# Altium schematic sheet Reset Bootloader and Mounting.SchDoc
size A; SheetNumber: 3; SheetTotal: 9
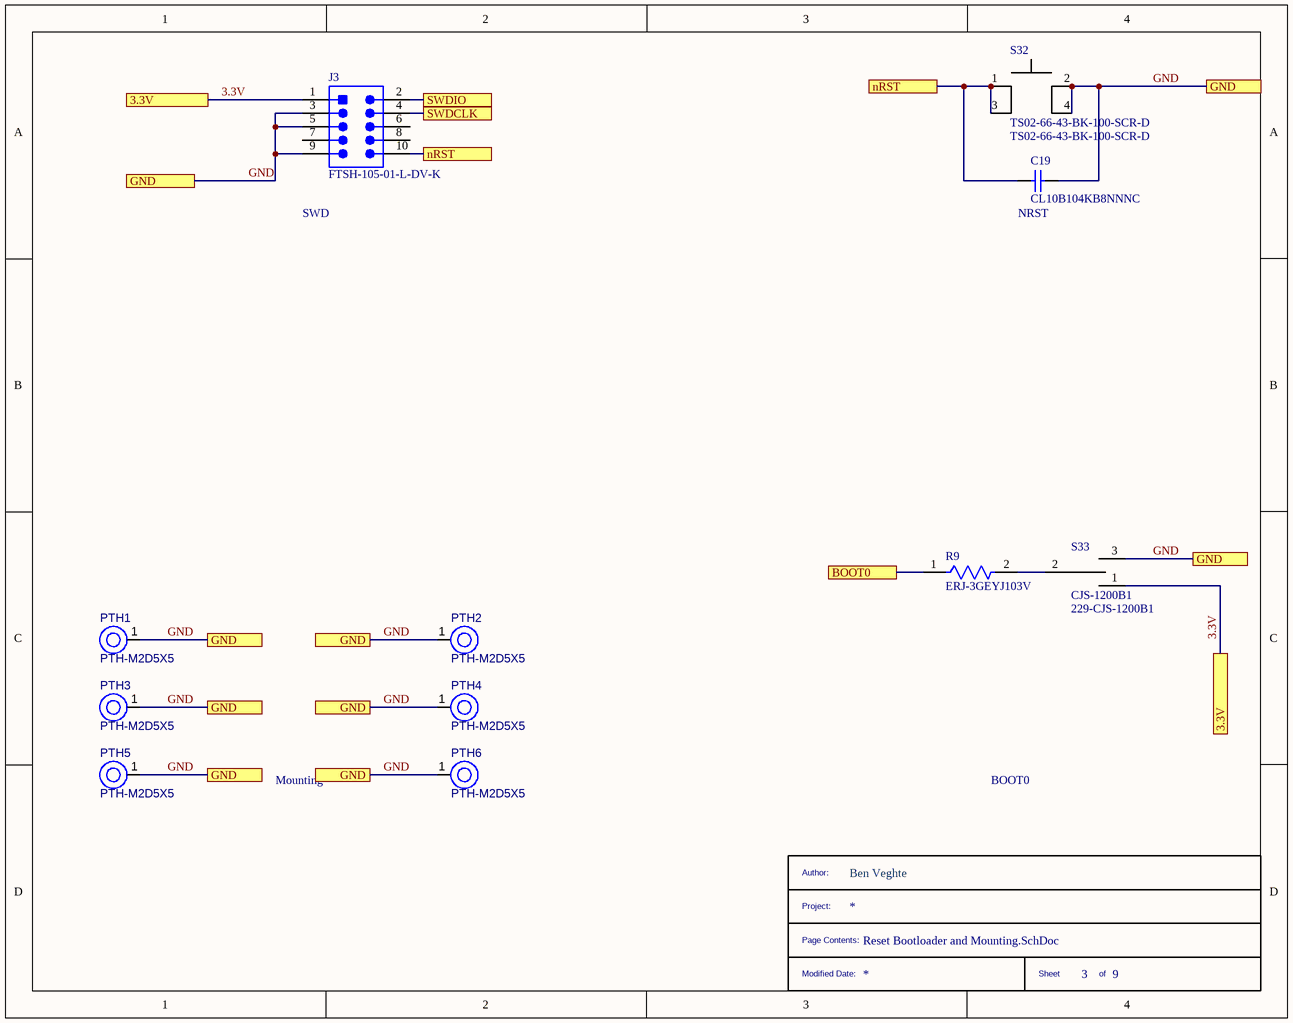
[diagram p0: Reset Bootloader and Mounting.SchDoc]

## Parts
*  __TITLE_BLOCK__  (value not drawn)  (graphical)
C19  CL10B104KB8NNNC  [SAMS-C0603-2_M]
J3  FTSH-105-01-L-DV-K  [SMTC-FTSH-105-01-L-DV-K_V]
PTH1  PTH-M2D5X5  [PTH-M2D5X5]
PTH2  PTH-M2D5X5  [PTH-M2D5X5]
PTH3  PTH-M2D5X5  [PTH-M2D5X5]
PTH4  PTH-M2D5X5  [PTH-M2D5X5]
PTH5  PTH-M2D5X5  [PTH-M2D5X5]
PTH6  PTH-M2D5X5  [PTH-M2D5X5]
R9  ERJ-3GEYJ103V  [FP-ERJ3G-IPC_C]
S32  TS02-66-43-BK-100-SCR-D  [TS02-66-43-BK-100-SCR-D]
S33  CJS-1200B1  Supplier Part Number 2: 229-CJS-1200B1  [CJS-1200B1]

## Ports
3.3V, BOOT0, GND, nRST, SWDCLK, SWDIO

## Nets
3.3V: J3.1 S33.1 ; port 3.3V
BOOT0: R9.1 ; port BOOT0
GND: C19.2 J3.3 J3.5 J3.9 PTH1.1(H1) PTH2.1(H1) PTH3.1(H1) PTH4.1(H1) PTH5.1(H1) PTH6.1(H1) S32.2 S32.4 S33.3 ; port GND
nRST: C19.1 J3.10 S32.1 S32.3 ; port nRST
SWDCLK: J3.4 ; port SWDCLK
SWDIO: J3.2 ; port SWDIO
NetR9_2: R9.2 S33.2

Not connected (* = marked no-connect by the designer): J3 6 7 8

## Notes on the sheet
- SWD
- (near C19) NRST
- Mounting
- BOOT0
- (in symbol __TITLE_BLOCK__) Author:; Ben Veghte; Project:; Page Contents:; Modified Date:; Sheet; of

## Library data of the parts
C19 = CMP-2000-05332-1: Multi-layer Ceramic Capacitor, -55 to 125 degC, 2-Pin SMD (0603), RoHS, Tape and Reel; Manufacturer: Samsung Electro-Mechanics; Capacitance: 0.1µF; Rated Voltage: 50V; Dielectric: X7R; Tolerance (%): ±10%; Case Size/Dimension: 0603; Datasheet URL: https://datasheet.ciiva.com/29198/456651-da-01-en-vs-kondensator-0605-29198839.pdf; Manufacturer URL: http://www.samsungsem.com/global/index.jsp; Datasheet Version: Nov-10
J3 = CMP-2000-05353-1: Male Header, Pitch 1.27 mm, 2 x 5 Position, Height 6.25 mm; Manufacturer: Samtec; Pitch: 0.050"(1.27mm); Other Names: Q3937619; Number of Positions: 10; Mating Products: SFMC-105-L2-S-D-TR-ND / -CONN.05"SURFACE10POSSMT / FLE-105-01-G-DV-TR-ND / -CONNSKT1.27MM10POSDUALSMD / FLE-105-01-G-DV-A-P-ND / -CONNSKT1.27MM10POSDUALSMD / FLE-105-01-G-DV-A-ND / -CONNSKT1.27MM10POSDUALSMD / CLP-105-02-G-D-P-TR-ND / -CONNRCPT10POSDUAL.05"SMD / SAM1155-05-ND / -CONNRCPT10POSDUAL.05"SMD / SAM1154-05-ND / -CONNRCPT10POSDUAL.05"SMD / SAM1153-05-ND / -CONNRCPT10POSDUAL.05"SMD / SAM1226-05-ND / -CONNRCPT.05"10POSDUALSMD; Number of Positions Loaded: All; Connector Type: Header,Unshrouded; Product Training Modules: Board-to-BoardConnectors; Datasheet Version: Rev. ET, 10/1995; Number of Rows: 2; Standard Package: 1; Package Description: Male Header, Pitch 1.27 mm, 2 x 5 Position, Height 5.97 mm, Tail Length 4.32 mm; Contact Finish Thickness: 10µin(0.25µm); Series: FTSH; Termination: Solder; Contact Type: MalePin; Color: Black; Package Reference: FTSH-105-01-L-DV-K; Family: RectangularConnectors-Headers,MalePins; Package URL: http://suddendocs.samtec.com/prints/ftsh-1xx-xx-xxx-dv-xxx-footprint.pdf; Packaging: Tube; Mounting Type: SurfaceMount; Category: Connectors,Interconnects; Datasheet URL: http://suddendocs.samtec.com/prints/ftsh-1xx-xx-xxx-dv-xxx-mkt.pdf; Row Spacing: 0.050"(1.27mm); Manufacturer URL: http://www.samtec.com/; Contact Mating Length: 0.120"(3.05mm); Contact Finish: Gold
PTH1-PTH6 = CMP-00028-00004-2: M2 PTH (2.5mm), 5mm pad; Pins: 1
R9 = CMP-2000-00704-2: RES SMD 10K OHM 5% 1/10W 0603; Temperature Coefficient: 200ppm/°C; Max Power Dissipation: 100mW; Resistance: 10kR; Voltage Rating (DC): 50V; Voltage Rating: 75V; Resistor Type: Thick Film; Tolerance: 5%; Military Standard: Not; Package Quantity: 1; Max Operating Temperature: 155°C; Mount: Surface Mount; Technology: THICK FILM; Case/Package: 0603; Construction: Rectangular; Depth: 0.8mm; Case Code (Imperial): 0603; Weight: 7.1E-05oz; Features: Automotive AEC-Q200; Packaging: Tape and Reel; Width: 0.8mm; Length: 1.6mm; Termination: SMD/SMT; Power Rating: 100mW; Lead Free: Lead Free; Number of Terminations: 2; Height: 0.45mm; RoHS Compliant: Yes; Min Operating Temperature: -55°C; Contact Plating: Tin; REACH SVHC: No SVHC; Resistance Tolerance: 5%; Series: ERJ; Working Voltage: 75V; Case Code (Metric): 1608
S32 = TS02-66-43-BK-100-SCR-D: Switch Tactile OFF (ON) SPST Round Button PC Pins 0.05A 12VDC 100000Cycles 1N Thru-Hole Bag; Manufacturer: CUI Devices; Supplier 1: Arrow Electronics; Manufacturer Part Number: TS02-66-43-BK-100-SCR-D; RoHS: No; Stock 1: 6000; Pricing 1: 1=0.09100, 25=0.08560, 100=0.07670, 250=0.07150, 500=0.06460, 1000=0.05270, 2000=0.05130, 5000=0.04740 (USD); Supplier Part Number 1: TS02-66-43-BK-100-SCR-D
S33 = CJS-1200B1: Switch Slide N.O./N.C. SPDT Raised Slide 0.1A 24VDC Gull Wing SMD Bulk; Manufacturer: CUI; Manufacturer Part Number: DS01-254-L-01BE; Max Voltage Rating (DC): 24V; Supplier 1: Mouser; RoHS: Yes; Supplier 2: Mouser; Category: DIP Switches; Stock 2: 600; Pricing 2: 1=0.73000, 10=0.64700, 20=0.63300, 50=0.63300, 100=0.63200, 200=0.56100, 500=0.53500, 1000=0.51700, 2000=0.49800, 10000=0.49800 (USD); Mount: Surface Mount; Case/Package: SMD/SMT; Contact Plating: Gold; Contact Material: Copper Alloy; Min Operating Temperature: -40°C; Max Operating Temperature: 85°C; Throw Configuration: SPDT; Packaging: Bulk; Termination: Gull Wing; Radiation Hardening: No; Lead Free: Lead Free; RoHS Compliant: Yes; ComponentLink1URL: https://www.nidec-copal-electronics.com/e/catalog/switch/cjs.pdf?src-supplier=Digi-Key; ComponentLink1Description: https://www.nidec-copal-electronics.com/e/catalog/switch/cjs.pdf?src-supplier=Digi-Key; ComponentLink2URL: http://www.nidec-copal-electronics.com/e/product/files/file/b1d651d581b7f6382a1a6c96f0c036e447720c59.pdf?src-supplier=Avnet; ComponentLink2Description: http://www.nidec-copal-electronics.com/e/product/files/file/b1d651d581b7f6382a1a6c96f0c036e447720c59.pdf?src-supplier=Avnet